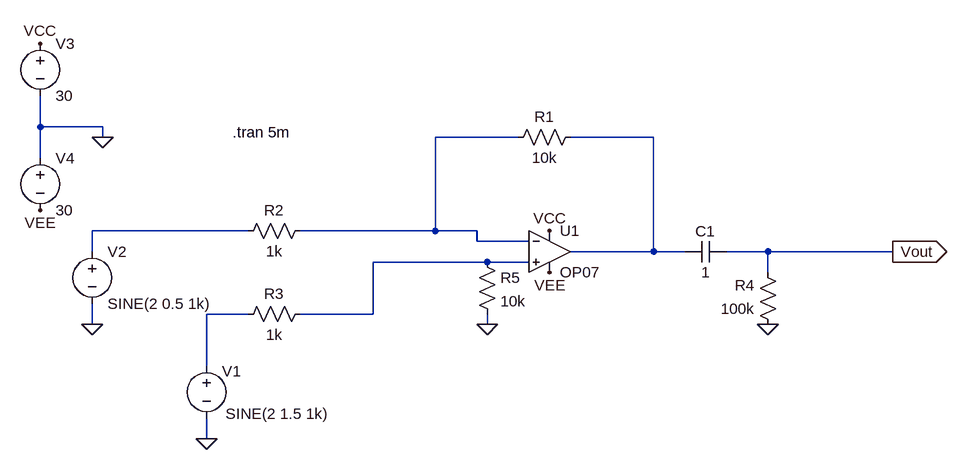
[diagram p0: schematic IdealOPamp_subtractor.asc]
IdealOPamp_subtractor.asc, the LTspice schematic file:
Version 4
SHEET 1 1072 680
WIRE -352 -176 -352 -224
WIRE -256 -176 -352 -176
WIRE -256 -160 -256 -176
WIRE 384 -160 256 -160
WIRE 592 -160 464 -160
WIRE -352 -128 -352 -176
WIRE -32 -16 -272 -16
WIRE 256 -16 256 -160
WIRE 256 -16 48 -16
WIRE 320 -16 256 -16
WIRE 320 0 320 -16
WIRE 400 0 320 0
WIRE -272 16 -272 -16
WIRE 592 16 592 -160
WIRE 592 16 464 16
WIRE 640 16 592 16
WIRE 768 16 704 16
WIRE 960 16 768 16
WIRE 336 32 160 32
WIRE 400 32 336 32
WIRE 768 48 768 16
WIRE -32 112 -96 112
WIRE 160 112 160 32
WIRE 160 112 48 112
WIRE -272 128 -272 96
WIRE 336 128 336 112
WIRE -96 192 -96 112
WIRE -96 304 -96 272
FLAG 960 16 Vout
IOPIN 960 16 Out
FLAG -256 -160 0
FLAG -352 -304 VCC
FLAG 432 -16 VCC
FLAG -352 -48 VEE
FLAG 432 48 VEE
FLAG -272 128 0
FLAG -96 304 0
FLAG 336 128 0
FLAG 768 128 0
SYMBOL res 480 -176 R90
WINDOW 0 0 56 VBottom 2
WINDOW 3 32 56 VTop 2
SYMATTR InstName R1
SYMATTR Value 10k
SYMBOL res 64 -32 R90
WINDOW 0 0 56 VBottom 2
WINDOW 3 32 56 VTop 2
SYMATTR InstName R2
SYMATTR Value 1k
SYMBOL res 64 96 R90
WINDOW 0 0 56 VBottom 2
WINDOW 3 32 56 VTop 2
SYMATTR InstName R3
SYMATTR Value 1k
SYMBOL voltage -96 176 R0
WINDOW 0 24 24 Left 2
WINDOW 3 29 89 Left 2
WINDOW 123 0 0 Left 0
WINDOW 39 0 0 Left 0
SYMATTR InstName V1
SYMATTR Value SINE(2 1.5 1k)
SYMBOL voltage -272 0 R0
WINDOW 123 0 0 Left 0
WINDOW 39 0 0 Left 0
SYMATTR InstName V2
SYMATTR Value SINE(2 0.5 1k)
SYMBOL Opamps\\OP07 432 -48 R0
SYMATTR InstName U1
SYMBOL voltage -352 -320 R0
WINDOW 123 0 0 Left 0
WINDOW 39 0 0 Left 0
SYMATTR InstName V3
SYMATTR Value 30
SYMBOL voltage -352 -144 R0
WINDOW 123 0 0 Left 0
WINDOW 39 0 0 Left 0
SYMATTR InstName V4
SYMATTR Value 30
SYMBOL res 784 144 R180
WINDOW 0 36 76 Left 2
WINDOW 3 36 40 Left 2
SYMATTR InstName R4
SYMATTR Value 100k
SYMBOL cap 704 0 R90
WINDOW 0 0 32 VBottom 2
WINDOW 3 32 32 VTop 2
SYMATTR InstName C1
SYMATTR Value 1
SYMBOL res 320 16 R0
SYMATTR InstName R5
SYMATTR Value 10k
TEXT -56 -168 Left 2 !.tran 5m

The netlist it stands for:
* IdealOPamp_subtractor.asc
R1 N002 N001 10k
R2 N001 N003 1k
R3 N004 N005 1k
V1 N005 0 SINE(2 1.5 1k)
V2 N003 0 SINE(2 0.5 1k)
XU1 N004 N001 VCC VEE N002 LT1001  ; OP07, pins In+ In- V+ V- OUT
V3 VCC 0 30
V4 0 VEE 30
R4 0 Vout 100k
C1 Vout N002 1
R5 N004 0 10k
.tran 5m
.lib LTC.lib
.backanno
.end